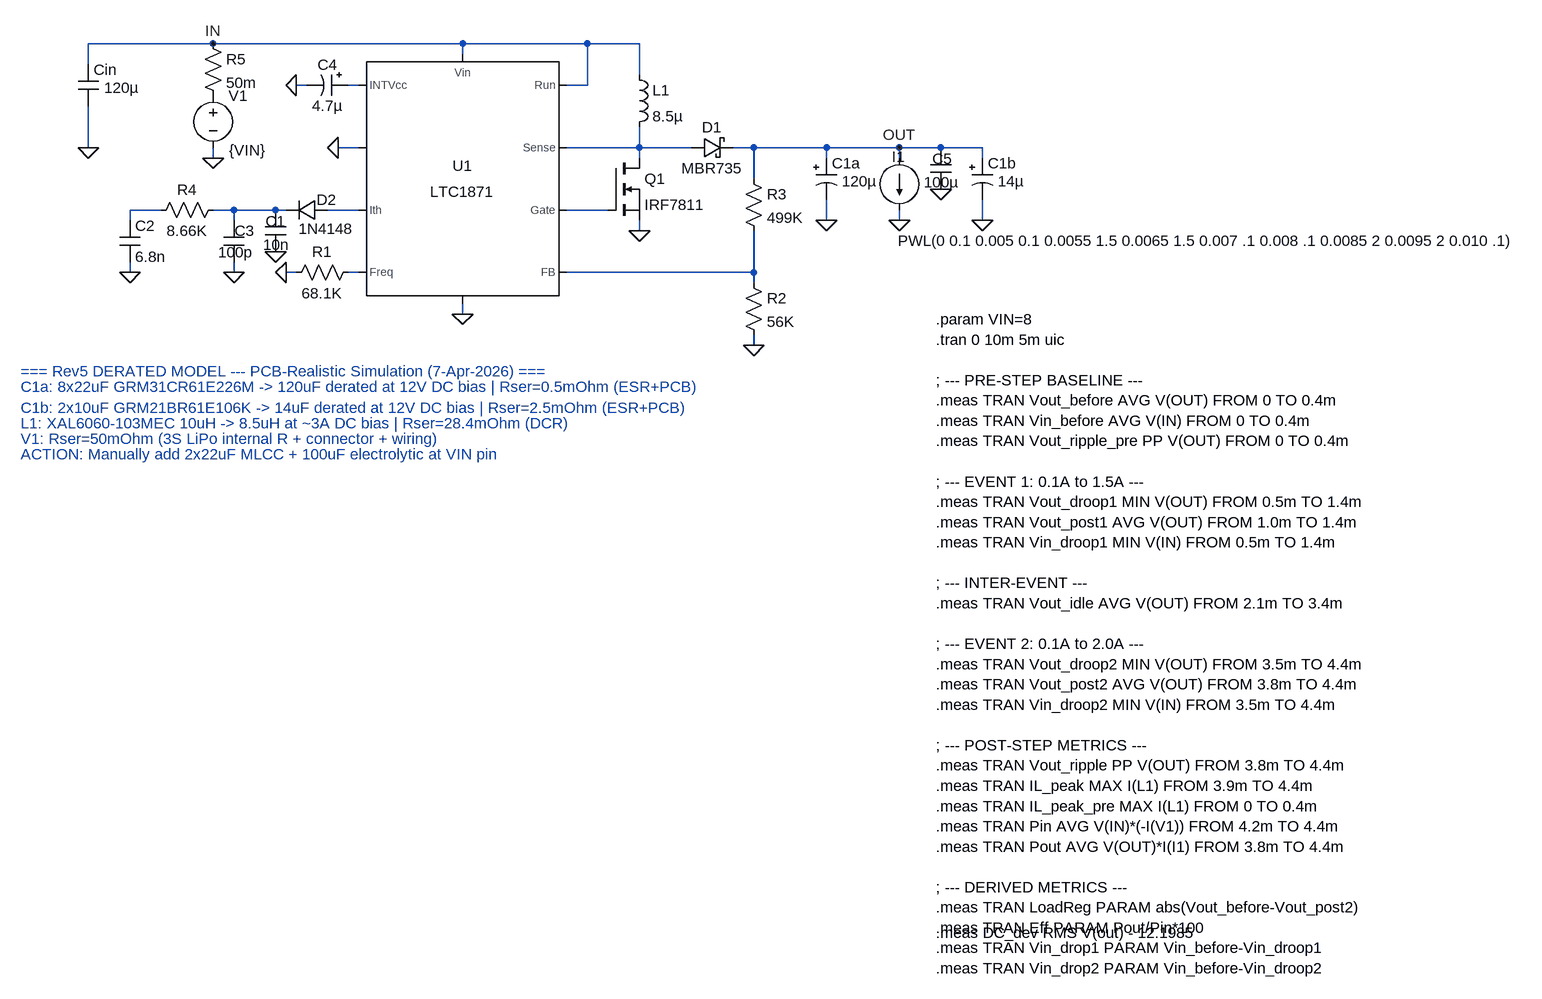
[diagram p0: schematic LTC1871_BOM_Caps_Rev5b_WithCin_2_Min_Value_Test.asc]
LTC1871_BOM_Caps_Rev5b_WithCin_2_Min_Value_Test.asc, the LTspice schematic file:
Version 4.1
SHEET 1 5664 2640
WIRE 1248 1168 1056 1168
WIRE 1632 1168 1248 1168
WIRE 1824 1168 1632 1168
WIRE 1904 1168 1824 1168
WIRE 1632 1184 1632 1168
WIRE 1056 1200 1056 1168
WIRE 1904 1216 1904 1168
WIRE 1392 1232 1376 1232
WIRE 1472 1232 1456 1232
WIRE 1824 1232 1824 1168
WIRE 1824 1232 1792 1232
WIRE 1056 1328 1056 1264
WIRE 1472 1328 1440 1328
WIRE 1904 1328 1904 1296
WIRE 1904 1328 1792 1328
WIRE 1984 1328 1904 1328
WIRE 2080 1328 2048 1328
WIRE 2192 1328 2080 1328
WIRE 2304 1328 2192 1328
WIRE 2368 1328 2304 1328
WIRE 2432 1328 2368 1328
WIRE 1248 1344 1248 1328
WIRE 1904 1344 1904 1328
WIRE 2192 1344 2192 1328
WIRE 2304 1344 2304 1328
WIRE 2432 1344 2432 1328
WIRE 2080 1376 2080 1328
WIRE 1168 1424 1120 1424
WIRE 1280 1424 1248 1424
WIRE 1344 1424 1280 1424
WIRE 1360 1424 1344 1424
WIRE 1472 1424 1424 1424
WIRE 1856 1424 1792 1424
WIRE 1120 1440 1120 1424
WIRE 1280 1440 1280 1424
WIRE 2192 1440 2192 1408
WIRE 2304 1440 2304 1424
WIRE 2432 1440 2432 1408
WIRE 1904 1456 1904 1440
WIRE 1120 1520 1120 1504
WIRE 1280 1520 1280 1504
WIRE 1376 1520 1360 1520
WIRE 1472 1520 1456 1520
WIRE 2080 1520 2080 1456
WIRE 2080 1520 1792 1520
WIRE 2080 1536 2080 1520
WIRE 1632 1584 1632 1568
WIRE 2080 1632 2080 1616
FLAG 1056 1328 0
FLAG 1904 1456 0
FLAG 1360 1520 0
FLAG 2080 1632 0
FLAG 1632 1584 0
FLAG 2192 1440 0
FLAG 1280 1520 0
FLAG 1120 1520 0
FLAG 2304 1440 0
FLAG 2432 1440 0
FLAG 1248 1344 0
FLAG 1440 1328 0
FLAG 1376 1232 0
FLAG 2304 1328 OUT
FLAG 1248 1168 IN
FLAG 1344 1488 0
FLAG 2368 1392 0
SYMBOL cap 1040 1200 R0
WINDOW 3 40 36 Left 2
SYMATTR Value 120µ
SYMATTR InstName Cin
SYMATTR SpiceLine Rser=0.010
SYMBOL NMOS 1856 1344 R0
SYMATTR InstName Q1
SYMATTR Value IRF7811
SYMBOL RES 1472 1504 R90
WINDOW 0 0 56 VBottom 2
WINDOW 3 32 56 VTop 2
SYMATTR InstName R1
SYMATTR Value 68.1K
SYMBOL res 2064 1520 R0
SYMATTR InstName R2
SYMATTR Value 56K
SYMBOL res 2064 1360 R0
SYMATTR InstName R3
SYMATTR Value 499K
SYMBOL ind 1888 1200 R0
SYMATTR InstName L1
SYMATTR Value 8.5µ
SYMATTR SpiceLine Rser=0.0284
SYMBOL schottky 1984 1344 R270
WINDOW 0 32 32 VTop 2
WINDOW 3 0 32 VBottom 2
SYMATTR InstName D1
SYMATTR Value MBR735
SYMBOL polcap 2176 1344 R0
WINDOW 40 27 64 Left 2
WINDOW 3 40 36 Left 2
SYMATTR Value 120µ
SYMATTR InstName C1a
SYMATTR SpiceLine Rser=0.0005
SYMBOL polcap 2416 1344 R0
WINDOW 40 27 64 Left 2
WINDOW 3 40 36 Left 2
SYMATTR Value 14µ
SYMATTR InstName C1b
SYMATTR SpiceLine Rser=0.0025
SYMBOL res 1264 1408 R90
WINDOW 0 0 56 VBottom 2
WINDOW 3 32 56 VTop 2
SYMATTR InstName R4
SYMATTR Value 8.66K
SYMBOL cap 1104 1440 R0
SYMATTR InstName C2
SYMATTR Value 6.8n
SYMBOL cap 1264 1440 R0
WINDOW 0 17 16 Left 2
WINDOW 3 -8 49 Left 2
SYMATTR InstName C3
SYMATTR Value 100p
SYMBOL POWERPRODUCTS\\LTC1871 1632 1376 R0
SYMATTR InstName U1
SYMBOL VOLTAGE 1248 1232 R0
WINDOW 123 0 0 Left 0
WINDOW 39 -11 -34 Left 0
WINDOW 3 25 100 Left 2
SYMATTR Value {VIN}
SYMATTR InstName V1
SYMBOL polcap 1456 1216 R90
WINDOW 0 0 32 VBottom 2
WINDOW 3 32 32 VTop 2
SYMATTR InstName C4
SYMATTR Value 4.7µ
SYMBOL current 2304 1344 R0
WINDOW 123 0 0 Left 0
WINDOW 39 0 0 Left 0
WINDOW 3 -2 127 Left 2
WINDOW 0 -11 -2 Left 2
SYMATTR Value PWL(0 0.1 0.005 0.1 0.0055 1.5 0.0065 1.5 0.007 .1 0.008 .1 0.0085 2 0.0095 2 0.010 .1)
SYMATTR InstName I1
SYMBOL diode 1424 1408 R90
WINDOW 0 16 1 VBottom 2
WINDOW 3 29 2 VTop 2
SYMATTR InstName D2
SYMATTR Value 1N4148
SYMBOL cap 1328 1424 R0
WINDOW 0 1 17 Left 2
WINDOW 3 -3 53 Left 2
SYMATTR InstName C1
SYMATTR Value 10n
SYMBOL res 1232 1152 R0
SYMATTR InstName R5
SYMATTR Value 50m
SYMBOL cap 2352 1328 R0
WINDOW 0 3 17 Left 2
WINDOW 3 -10 53 Left 2
SYMATTR InstName C5
SYMATTR Value 100µ
TEXT 2360 1592 Left 2 !.param VIN=8\n.tran 0 10m 5m uic\n \n; --- PRE-STEP BASELINE ---\n.meas TRAN Vout_before AVG V(OUT) FROM 0 TO 0.4m\n.meas TRAN Vin_before AVG V(IN) FROM 0 TO 0.4m\n.meas TRAN Vout_ripple_pre PP V(OUT) FROM 0 TO 0.4m\n \n; --- EVENT 1: 0.1A to 1.5A ---\n.meas TRAN Vout_droop1 MIN V(OUT) FROM 0.5m TO 1.4m\n.meas TRAN Vout_post1 AVG V(OUT) FROM 1.0m TO 1.4m\n.meas TRAN Vin_droop1 MIN V(IN) FROM 0.5m TO 1.4m\n \n; --- INTER-EVENT ---\n.meas TRAN Vout_idle AVG V(OUT) FROM 2.1m TO 3.4m\n \n; --- EVENT 2: 0.1A to 2.0A ---\n.meas TRAN Vout_droop2 MIN V(OUT) FROM 3.5m TO 4.4m\n.meas TRAN Vout_post2 AVG V(OUT) FROM 3.8m TO 4.4m\n.meas TRAN Vin_droop2 MIN V(IN) FROM 3.5m TO 4.4m\n \n; --- POST-STEP METRICS ---\n.meas TRAN Vout_ripple PP V(OUT) FROM 3.8m TO 4.4m\n.meas TRAN IL_peak MAX I(L1) FROM 3.9m TO 4.4m\n.meas TRAN IL_peak_pre MAX I(L1) FROM 0 TO 0.4m\n.meas TRAN Pin AVG V(IN)*(-I(V1)) FROM 4.2m TO 4.4m\n.meas TRAN Pout AVG V(OUT)*I(I1) FROM 3.8m TO 4.4m\n \n; --- DERIVED METRICS ---\n.meas TRAN LoadReg PARAM abs(Vout_before-Vout_post2)\n.meas TRAN Eff PARAM Pout/Pin*100\n.meas TRAN Vin_drop1 PARAM Vin_before-Vin_droop1\n.meas TRAN Vin_drop2 PARAM Vin_before-Vin_droop2
TEXT 2360 2536 Left 2 !.meas DC_dev RMS V(out) - 12.1985
TEXT 952 1672 Left 2 ;=== Rev5 DERATED MODEL --- PCB-Realistic Simulation (7-Apr-2026) ===
TEXT 952 1696 Left 2 ;C1a: 8x22uF GRM31CR61E226M -> 120uF derated at 12V DC bias | Rser=0.5mOhm (ESR+PCB)
TEXT 952 1728 Left 2 ;C1b: 2x10uF GRM21BR61E106K -> 14uF derated at 12V DC bias | Rser=2.5mOhm (ESR+PCB)
TEXT 952 1752 Left 2 ;L1: XAL6060-103MEC 10uH -> 8.5uH at ~3A DC bias | Rser=28.4mOhm (DCR)
TEXT 952 1776 Left 2 ;V1: Rser=50mOhm (3S LiPo internal R + connector + wiring)
TEXT 952 1800 Left 2 ;ACTION: Manually add 2x22uF MLCC + 100uF electrolytic at VIN pin

The netlist it stands for:
* LTC1871_BOM_Caps_Rev5b_WithCin_2_Min_Value_Test.asc
Cin IN 0 120µ Rser=0.010
M§Q1 N002 N006 0 0 IRF7811
R1 N007 0 68.1K
R2 N008 0 56K
R3 OUT N008 499K
L1 IN N002 8.5µ Rser=0.0284
D1 N002 OUT MBR735
C1a OUT 0 120µ Rser=0.0005
C1b OUT 0 14µ Rser=0.0025
R4 N004 N003 8.66K
C2 N003 0 6.8n
C3 N004 0 100p
X§U1 IN N005 N008 N007 0 0 N006 N001 IN N002 LTC1871  ; pins Run Ith FB Freq ? ? Gate INTVcc Vin Sense
V1 P001 0 {VIN}
C4 N001 0 4.7µ
I1 OUT 0 PWL(0 0.1 0.005 0.1 0.0055 1.5 0.0065 1.5 0.007 .1 0.008 .1 0.0085 2 0.0095 2 0.010 .1)
D2 N005 N004 1N4148
C1 N004 0 10n
R5 IN P001 50m
C5 OUT 0 100µ
.model D D
.lib standard.dio
.model NMOS NMOS
.model PMOS PMOS
.lib standard.mos
.param VIN=8
.tran 0 10m 5m uic
; --- PRE-STEP BASELINE ---
.meas TRAN Vout_before AVG V(OUT) FROM 0 TO 0.4m
.meas TRAN Vin_before AVG V(IN) FROM 0 TO 0.4m
.meas TRAN Vout_ripple_pre PP V(OUT) FROM 0 TO 0.4m
; --- EVENT 1: 0.1A to 1.5A ---
.meas TRAN Vout_droop1 MIN V(OUT) FROM 0.5m TO 1.4m
.meas TRAN Vout_post1 AVG V(OUT) FROM 1.0m TO 1.4m
.meas TRAN Vin_droop1 MIN V(IN) FROM 0.5m TO 1.4m
; --- INTER-EVENT ---
.meas TRAN Vout_idle AVG V(OUT) FROM 2.1m TO 3.4m
; --- EVENT 2: 0.1A to 2.0A ---
.meas TRAN Vout_droop2 MIN V(OUT) FROM 3.5m TO 4.4m
.meas TRAN Vout_post2 AVG V(OUT) FROM 3.8m TO 4.4m
.meas TRAN Vin_droop2 MIN V(IN) FROM 3.5m TO 4.4m
; --- POST-STEP METRICS ---
.meas TRAN Vout_ripple PP V(OUT) FROM 3.8m TO 4.4m
.meas TRAN IL_peak MAX I(L1) FROM 3.9m TO 4.4m
.meas TRAN IL_peak_pre MAX I(L1) FROM 0 TO 0.4m
.meas TRAN Pin AVG V(IN)*(-I(V1)) FROM 4.2m TO 4.4m
.meas TRAN Pout AVG V(OUT)*I(I1) FROM 3.8m TO 4.4m
; --- DERIVED METRICS ---
.meas TRAN LoadReg PARAM abs(Vout_before-Vout_post2)
.meas TRAN Eff PARAM Pout/Pin*100
.meas TRAN Vin_drop1 PARAM Vin_before-Vin_droop1
.meas TRAN Vin_drop2 PARAM Vin_before-Vin_droop2
.meas DC_dev RMS V(out) - 12.1985
* === Rev5 DERATED MODEL --- PCB-Realistic Simulation (7-Apr-2026) ===
* C1a: 8x22uF GRM31CR61E226M -> 120uF derated at 12V DC bias | Rser=0.5mOhm (ESR+PCB)
* C1b: 2x10uF GRM21BR61E106K -> 14uF derated at 12V DC bias | Rser=2.5mOhm (ESR+PCB)
* L1: XAL6060-103MEC 10uH -> 8.5uH at ~3A DC bias | Rser=28.4mOhm (DCR)
* V1: Rser=50mOhm (3S LiPo internal R + connector + wiring)
* ACTION: Manually add 2x22uF MLCC + 100uF electrolytic at VIN pin
.lib LTC1871.sub
.backanno
.end